# EAGLE schematic powerBoard (EAGLE 7.4.0)
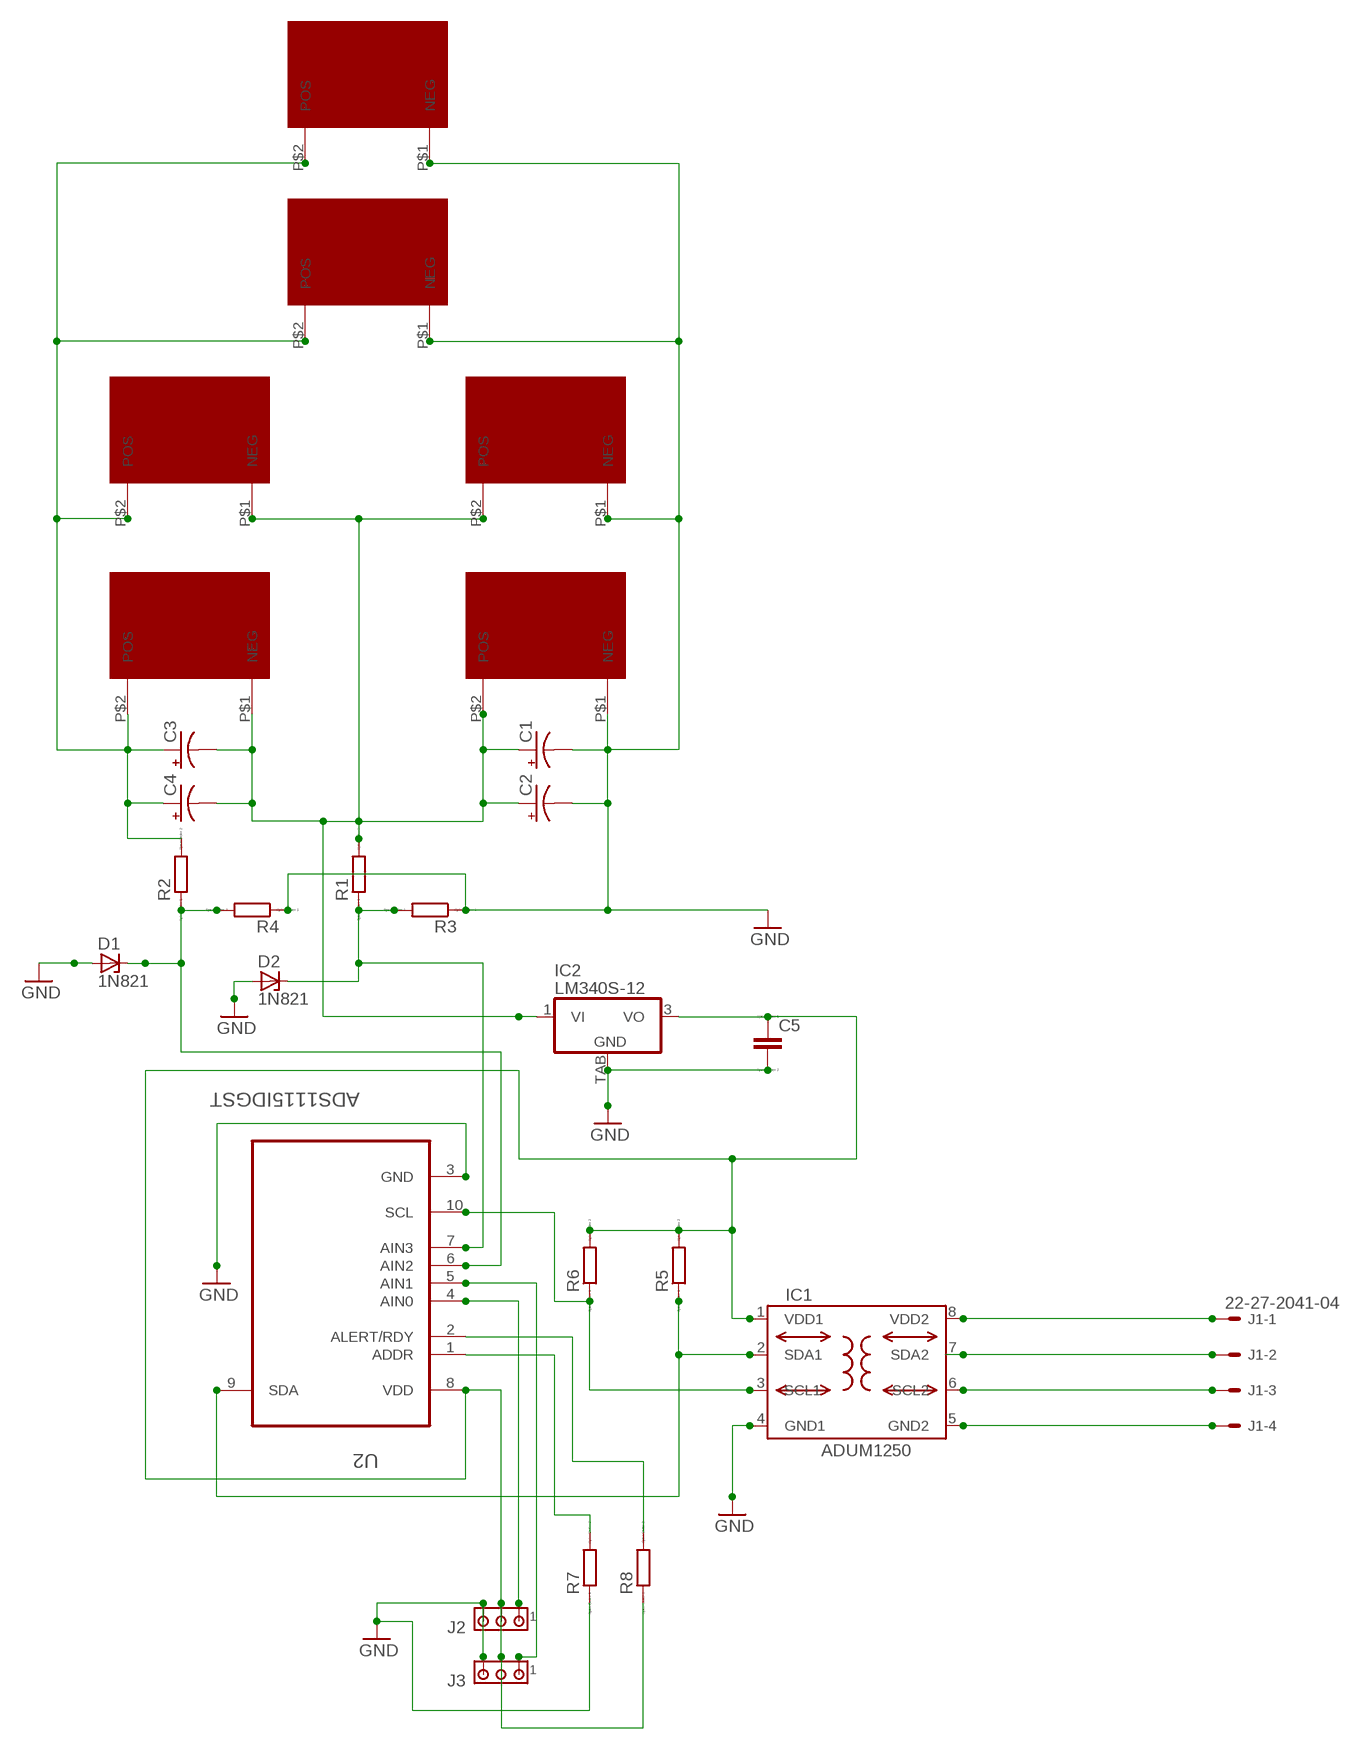
[diagram p0: schematic, sheet 1]

## Parts
C1  CPOL-USE7.5-16  [E7,5-16]
C2  CPOL-USE7.5-16  [E7,5-16]
C3  CPOL-USE7.5-16  [E7,5-16]
C4  CPOL-USE7.5-16  [E7,5-16]
C5  CC2012  [C2012]
D1  1N821  [DO35Z10]
D2  1N821  [DO35Z10]
IC1  ADUM1250  [SO8-COOL]
IC2  LM340S-12  [TO263-3]
J1  22-27-2041-04  [6410-04]
J2  MTA03-100  [10X03MTA]
J3  MTA03-100  [10X03MTA]
R1  RR1206  [R1206]
R2  RR1206  [R1206]
R3  RR1206  [R1206]
R4  RR1206  [R1206]
R5  RR1005  [R1005]
R6  RR1005  [R1005]
R7  RR1005  [R1005]
R8  RR1005  [R1005]
U2  ADS1115IDGST  [SOP50P490X110-10N]
U$1  XT60  [XT60]
U$2  XT60  [XT60]
U$3  XT60  [XT60]
U$4  XT60  [XT60]
U$5  XT60  [XT60]
U$6  XT60  [XT60]

## Nets
GND: C1.- C2.- C5.2 D1.A D2.A IC1.4(GND1) IC2.TAB(GND) J2.3 J3.3 R3.1 R4.1 R7.1 U2.3(GND) U$1.P$1(NEG) U$4.P$1(NEG) U$5.P$1(NEG) U$6.P$1(NEG)
GND2: IC1.5(GND2) J1.4
MID: C1.+ C2.+ C3.- C4.- IC2.1(VI) R1.2 U$1.P$2(POS) U$2.P$1(NEG) U$3.P$1(NEG) U$4.P$2(POS)
N$1: R7.2 U2.1(ADDR)
N$2: R8.2 U2.2(ALERT/RDY)
N$3: J2.1 U2.4(AIN0)
N$4: J3.1 U2.5(AIN1)
N$5: IC1.3(SCL1) R6.1 U2.10(SCL)
N$7: D1.C R2.1 R4.2 U2.6(AIN2)
N$10: IC1.2(SDA1) R5.1 U2.9(SDA)
N$11: IC1.7(SDA2) J1.2
N$12: IC1.6(SCL2) J1.3
N$14: D2.C R1.1 R3.2 U2.7(AIN3)
POS: C3.+ C4.+ R2.2 U$2.P$2(POS) U$3.P$2(POS) U$5.P$2(POS) U$6.P$2(POS)
VDD1: C5.1 IC1.1(VDD1) IC2.3(VO) J2.2 J3.2 R5.2 R6.2 R8.1 U2.8(VDD)
VDD2: IC1.8(VDD2) J1.1

## Library data of the parts
C1-C4 = rcl:CPOL-US: POLARIZED CAPACITOR, American symbol
C5 = eagle-ltspice:C: CAPACITOR, European symbol; SPICEMODEL: NONE; SPICEPREFIX: C
D1 D2 = diode:1N821: Reference DIODE temperature compensated, 6,2 V
IC1 = analog-devices-3:ADUM1250: Hot Swappable, Dual I2C Isolators Source: http://www.analog.com/static/imported-files/data_sheets/ADUM1250_1251.pdf
IC2 = linear:LM340?-*: Positive VOLTAGE REGULATOR Source: http://cache.national.com/ds/LM/LM340.pdf
J1 = con-molex:22-?-04: CONNECTOR wire to board 2.54 mm (.1 inch) pitch header; OC_FARNELL: unknown; OC_NEWARK: unknown
J2 J3 = con-amp:MTA03-100: AMP connector
R1-R8 = eagle-ltspice:R: RESISTOR, European symbol; SPICEMODEL: NONE; SPICEPREFIX: R
U2 = Texas Instruments_By_element14_Batch_1:ADS1115IDGST: Analog-to-Digital Converter with Internal Reference; MPN: ADS1115IDGST; OC_FARNELL: 1762981; OC_NEWARK: 25R1241; PACKAGE: MSOP-10; SUPPLIER: Texas Instruments
U$1-U$6 = hans:XT60

## Net classes
0 default: width 0.076 mm, drill 0.102 mm, clearance 0.076 mm
1 GND: width 0.127 mm, clearance 0.127 mm